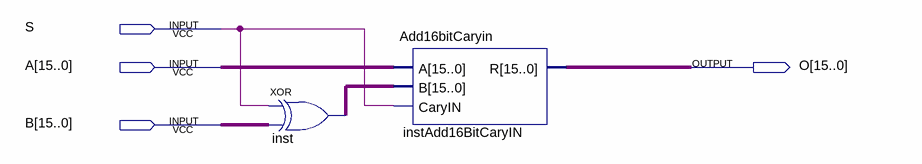
[diagram p0: schematic sheet]
// Quartus schematic AddSubUpdate.bdf as structural Verilog: 2 symbols, 4 pins
module AddSubUpdate (
  input  S,
  input  [15:0] A,
  input  [15:0] B,
  output [15:0] O
);

  wire [15:0] inst_out;

  assign inst_out = {16{S}} ^ B;  // XOR inst, 16 bits wide
  Add16bitCaryin instAdd16BitCaryIN (.A(A), .B(inst_out), .CaryIN(S), .R(O));
endmodule
